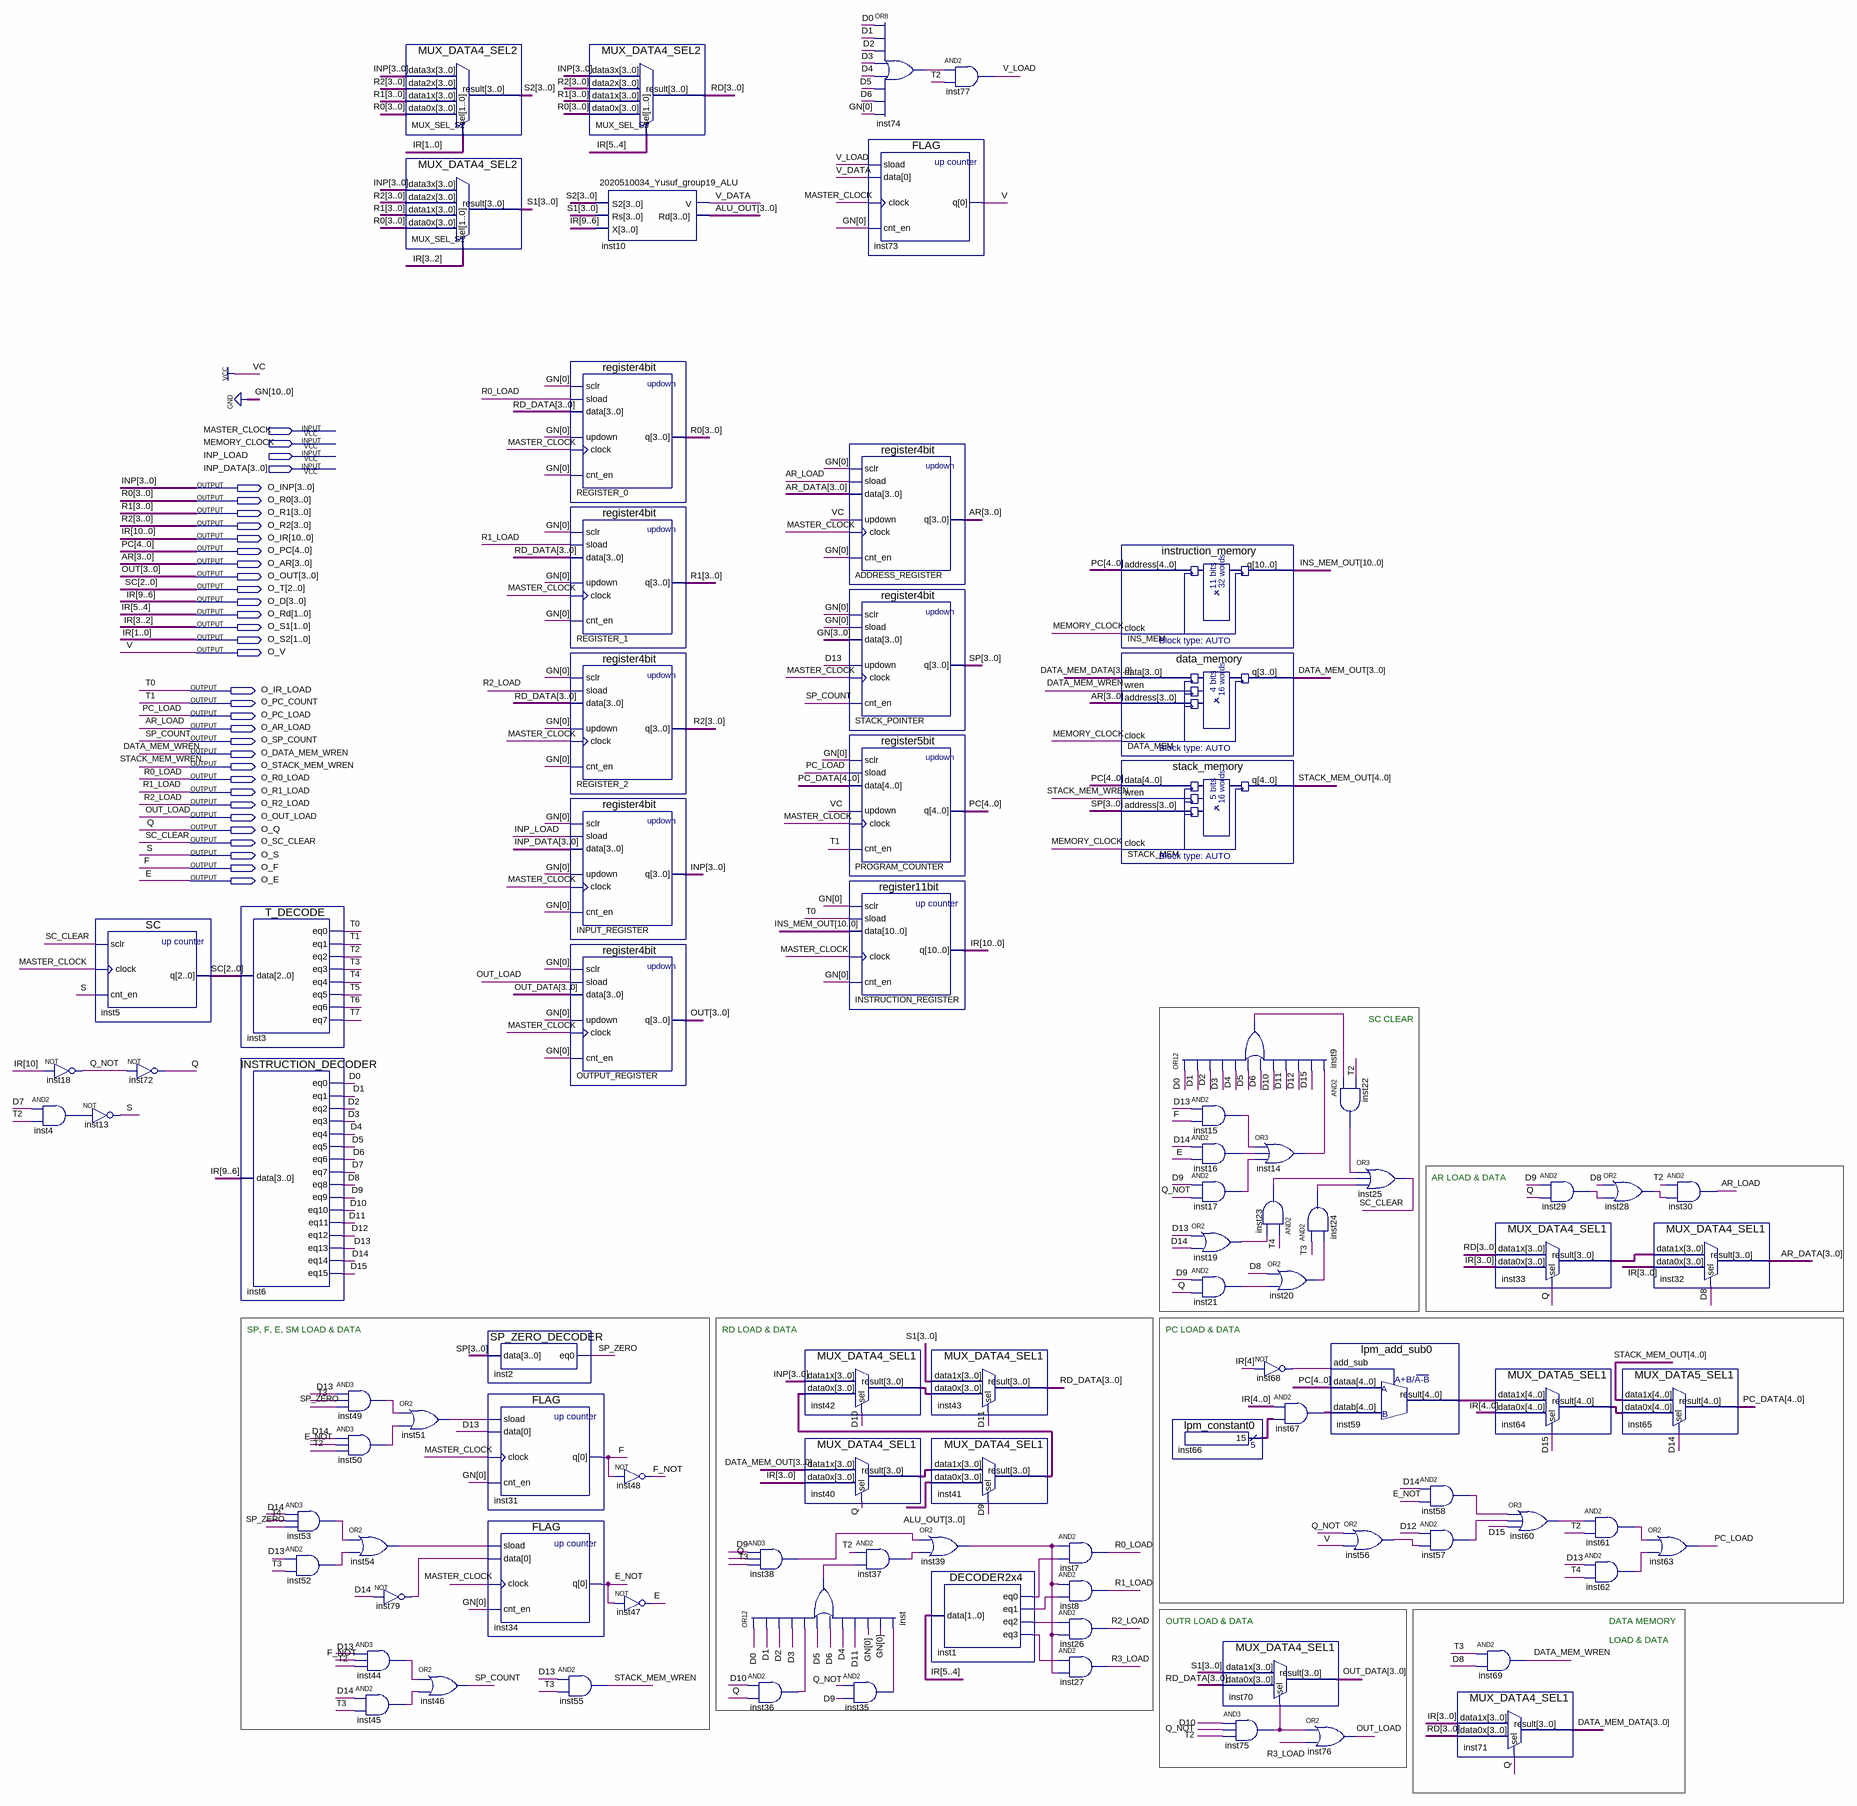
[diagram p0: schematic sheet]
// Quartus schematic 2021510008_Alperen_Aydin_Group19_Lab14_Project_DEUARC_COMBINED.bdf as structural Verilog: 92 symbols, 34 pins
module \2021510008_Alperen_Aydin_Group19_Lab14_Project_DEUARC_COMBINED  (
  input  MASTER_CLOCK,
  input  MEMORY_CLOCK,
  input  INP_LOAD,
  input  [3:0] INP_DATA,
  output [3:0] O_INP,
  output [3:0] O_R0,
  output [3:0] O_R1,
  output [3:0] O_R2,
  output [10:0] O_IR,
  output [4:0] O_PC,
  output [3:0] O_AR,
  output [3:0] O_OUT,
  output [2:0] O_T,
  output [3:0] O_D,
  output [1:0] O_Rd,
  output [1:0] O_S1,
  output [1:0] O_S2,
  output O_V,
  output O_IR_LOAD,
  output O_PC_COUNT,
  output O_PC_LOAD,
  output O_AR_LOAD,
  output O_SP_COUNT,
  output O_DATA_MEM_WREN,
  output O_STACK_MEM_WREN,
  output O_R0_LOAD,
  output O_R1_LOAD,
  output O_R2_LOAD,
  output O_OUT_LOAD,
  output O_Q,
  output O_SC_CLEAR,
  output O_S,
  output O_F,
  output O_E
);

  wire D0, D1, D2, D3, D4, D5, D6, D7, D8, D9, D10, D11, D12, D13, D14, D15, E_NOT, F_NOT, inst1_eq0,
       inst1_eq1, inst1_eq2, inst1_eq3, inst4_out, inst9_out, inst14_out, inst15_out, inst16_out, inst17_out,
       inst19_out, inst20_out, inst21_out, inst22_out, inst23_out, inst24_out, inst28_out, inst29_out,
       inst35_out, inst36_out, inst37_out, inst38_out, inst39_out, inst44_out, inst45_out, inst49_out,
       inst50_out, inst51_out, inst52_out, inst53_out, inst54_out, inst56_out, inst57_out, inst58_out,
       inst60_out, inst61_out, inst62_out, inst68_out, inst74_out, inst75_out, inst79_out, inst_out, Q_NOT,
       R3_LOAD, SP_ZERO, T2, T3, T4, T5, T6, T7, V_DATA, V_LOAD;
  wire [3:0] ALU_OUT, AR_DATA, DATA_MEM_DATA, DATA_MEM_OUT, inst33_result, inst40_result, inst41_result,
       inst42_result, OUT_DATA, RD, RD_DATA, S1, S2, SP;
  wire [4:0] inst59_result, inst64_result, inst66_result, inst67_out, PC_DATA, STACK_MEM_OUT;
  wire [10:0] INS_MEM_OUT;

  not inst18 (Q_NOT, O_IR[10]);
  and inst4 (inst4_out, D7, T2);
  SC inst5 (.sclr(O_SC_CLEAR), .clock(MASTER_CLOCK), .cnt_en(O_S), .q(O_T));
  not inst13 (O_S, inst4_out);
  not inst72 (O_Q, Q_NOT);
  T_DECODE inst3 (
    .data(O_T), .eq0(O_IR_LOAD), .eq1(O_PC_COUNT), .eq2(T2), .eq3(T3), .eq4(T4), .eq5(T5), .eq6(T6), .eq7(T7));
  INSTRUCTION_DECODER inst6 (
    .data(O_D), .eq0(D0), .eq1(D1), .eq2(D2), .eq3(D3), .eq4(D4), .eq5(D5), .eq6(D6), .eq7(D7), .eq8(D8),
    .eq9(D9), .eq10(D10), .eq11(D11), .eq12(D12), .eq13(D13), .eq14(D14), .eq15(D15));
  and inst53 (inst53_out, D14, T4, SP_ZERO);
  and inst52 (inst52_out, D13, T3);
  and inst49 (inst49_out, D13, T3, SP_ZERO);
  and inst50 (inst50_out, D14, E_NOT, T2);
  or inst54 (inst54_out, inst53_out, inst52_out);
  and inst44 (inst44_out, D13, F_NOT, T2);
  and inst45 (inst45_out, D14, T3);
  MUX_DATA4_SEL2 MUX_SEL_S2 (.data3x(O_INP), .data2x(O_R2), .data1x(O_R1), .data0x(O_R0), .sel(O_IR[1:0]), .result(S2));
  MUX_DATA4_SEL2 MUX_SEL_S1 (.data3x(O_INP), .data2x(O_R2), .data1x(O_R1), .data0x(O_R0), .sel(O_IR[3:2]), .result(S1));
  or inst51 (inst51_out, inst49_out, inst50_out);
  not inst79 (inst79_out, D14);
  or inst46 (O_SP_COUNT, inst44_out, inst45_out);
  SP_ZERO_DECODER inst2 (.data(SP), .eq0(SP_ZERO));
  FLAG inst31 (.sload(inst51_out), .data(D13), .clock(MASTER_CLOCK), .cnt_en(1'b0), .q(O_F));
  FLAG inst34 (.sload(inst54_out), .data(inst79_out), .clock(MASTER_CLOCK), .cnt_en(1'b0), .q(E_NOT));
  register4bit REGISTER_0 (
    .sclr(1'b0), .sload(O_R0_LOAD), .data(RD_DATA), .updown(1'b0), .clock(MASTER_CLOCK), .cnt_en(1'b0),
    .q(O_R0));
  register4bit REGISTER_1 (
    .sclr(1'b0), .sload(O_R1_LOAD), .data(RD_DATA), .updown(1'b0), .clock(MASTER_CLOCK), .cnt_en(1'b0),
    .q(O_R1));
  register4bit REGISTER_2 (
    .sclr(1'b0), .sload(O_R2_LOAD), .data(RD_DATA), .updown(1'b0), .clock(MASTER_CLOCK), .cnt_en(1'b0),
    .q(O_R2));
  register4bit INPUT_REGISTER (
    .sclr(1'b0), .sload(INP_LOAD), .data(INP_DATA), .updown(1'b0), .clock(MASTER_CLOCK), .cnt_en(1'b0),
    .q(O_INP));
  register4bit OUTPUT_REGISTER (
    .sclr(1'b0), .sload(O_OUT_LOAD), .data(OUT_DATA), .updown(1'b0), .clock(MASTER_CLOCK), .cnt_en(1'b0),
    .q(O_OUT));
  and inst55 (O_STACK_MEM_WREN, D13, T3);
  MUX_DATA4_SEL2 MUX_SEL_S3 (.data3x(O_INP), .data2x(O_R2), .data1x(O_R1), .data0x(O_R0), .sel(O_IR[5:4]), .result(RD));
  \2020510034_Yusuf_group19_ALU  inst10 (.S2(S2), .Rs(S1), .X(O_D), .V(V_DATA), .Rd(ALU_OUT));
  not inst48 (F_NOT, O_F);
  not inst47 (O_E, E_NOT);
  and inst38 (inst38_out, D9, O_Q, T3);
  or inst (inst_out, D0, D1, D2, D3, inst36_out, D5, D6, D4, D11, 1'b0, 1'b0, inst35_out);
  and inst36 (inst36_out, D10, O_Q);
  MUX_DATA4_SEL1 inst42 (.data1x(O_INP), .data0x(inst41_result), .sel(D10), .result(inst42_result));
  MUX_DATA4_SEL1 inst40 (.data1x(DATA_MEM_OUT), .data0x(O_IR[3:0]), .sel(O_Q), .result(inst40_result));
  or inst74 (inst74_out, D0, D1, D2, D3, D4, D5, D6, 1'b0);
  FLAG inst73 (.sload(V_LOAD), .data(V_DATA), .clock(MASTER_CLOCK), .cnt_en(1'b0), .q(O_V));
  register4bit ADDRESS_REGISTER (
    .sclr(1'b0), .sload(O_AR_LOAD), .data(AR_DATA), .updown(1'b1), .clock(MASTER_CLOCK), .cnt_en(1'b0),
    .q(O_AR));
  register4bit STACK_POINTER (
    .sclr(1'b0), .sload(1'b0), .data(4'b0000), .updown(D13), .clock(MASTER_CLOCK), .cnt_en(O_SP_COUNT), .q(SP));
  register5bit PROGRAM_COUNTER (
    .sclr(1'b0), .sload(O_PC_LOAD), .data(PC_DATA), .updown(1'b1), .clock(MASTER_CLOCK), .cnt_en(O_PC_COUNT),
    .q(O_PC));
  register11bit INSTRUCTION_REGISTER (
    .sclr(1'b0), .sload(O_IR_LOAD), .data(INS_MEM_OUT), .clock(MASTER_CLOCK), .cnt_en(1'b0),
    .q({O_IR[10], O_D, O_IR[5:0]}));
  and inst37 (inst37_out, T2, inst_out);
  and inst35 (inst35_out, Q_NOT, D9);
  or inst39 (inst39_out, inst38_out, inst37_out);
  and inst77 (V_LOAD, inst74_out, T2);
  MUX_DATA4_SEL1 inst43 (.data1x(S1), .data0x(inst42_result), .sel(D11), .result(RD_DATA));
  MUX_DATA4_SEL1 inst41 (.data1x(inst40_result), .data0x(ALU_OUT), .sel(D9), .result(inst41_result));
  DECODER2x4 inst1 (.data(O_IR[5:4]), .eq0(inst1_eq0), .eq1(inst1_eq1), .eq2(inst1_eq2), .eq3(inst1_eq3));
  and inst7 (O_R0_LOAD, inst39_out, inst1_eq0);
  and inst8 (O_R1_LOAD, inst39_out, inst1_eq1);
  and inst26 (O_R2_LOAD, inst1_eq2, inst39_out);
  and inst27 (R3_LOAD, inst1_eq3, inst39_out);
  instruction_memory INS_MEM (.address(O_PC), .clock(MEMORY_CLOCK), .q(INS_MEM_OUT));
  data_memory DATA_MEM (
    .data(DATA_MEM_DATA), .wren(O_DATA_MEM_WREN), .address(O_AR), .clock(MEMORY_CLOCK), .q(DATA_MEM_OUT));
  stack_memory STACK_MEM (.data(O_PC), .wren(O_STACK_MEM_WREN), .address(SP), .clock(MEMORY_CLOCK), .q(STACK_MEM_OUT));
  or inst9 (inst9_out, D0, D1, D2, D3, D4, D5, D6, D10, D11, D12, D15, inst14_out);
  lpm_constant0 inst66 (.result(inst66_result));
  and inst15 (inst15_out, D13, O_F);
  and inst16 (inst16_out, D14, O_E);
  and inst17 (inst17_out, D9, Q_NOT);
  or inst19 (inst19_out, D13, D14);
  and inst21 (inst21_out, D9, O_Q);
  MUX_DATA4_SEL1 inst70 (.data1x(S1), .data0x(RD_DATA), .sel(inst75_out), .result(OUT_DATA));
  and inst75 (inst75_out, D10, Q_NOT, T2);
  or inst14 (inst14_out, inst15_out, inst16_out, inst17_out);
  and inst23 (inst23_out, T4, inst19_out);
  or inst20 (inst20_out, D8, inst21_out);
  not inst68 (inst68_out, O_IR[4]);
  assign inst67_out = O_IR[4:0] & inst66_result;  // AND2 inst67, 5 bits wide
  and inst22 (inst22_out, inst9_out, T2);
  and inst24 (inst24_out, T3, inst20_out);
  lpm_add_sub0 inst59 (.add_sub(inst68_out), .dataa(O_PC), .datab(inst67_out), .result(inst59_result));
  or inst76 (O_OUT_LOAD, inst75_out, R3_LOAD);
  or inst25 (O_SC_CLEAR, inst22_out, inst23_out, inst24_out);
  or inst56 (inst56_out, Q_NOT, O_V);
  and inst58 (inst58_out, D14, E_NOT);
  and inst57 (inst57_out, D12, inst56_out);
  and inst69 (O_DATA_MEM_WREN, T3, D8);
  MUX_DATA4_SEL1 inst71 (.data1x(O_IR[3:0]), .data0x(RD), .sel(O_Q), .result(DATA_MEM_DATA));
  MUX_DATA4_SEL1 inst33 (.data1x(RD), .data0x(O_IR[3:0]), .sel(O_Q), .result(inst33_result));
  MUX_DATA5_SEL1 inst64 (.data1x(inst59_result), .data0x(O_IR[4:0]), .sel(D15), .result(inst64_result));
  or inst60 (inst60_out, inst58_out, inst57_out, D15);
  and inst29 (inst29_out, D9, O_Q);
  and inst61 (inst61_out, inst60_out, T2);
  and inst62 (inst62_out, D13, T4);
  or inst28 (inst28_out, D8, inst29_out);
  MUX_DATA5_SEL1 inst65 (.data1x(STACK_MEM_OUT), .data0x(inst64_result), .sel(D14), .result(PC_DATA));
  and inst30 (O_AR_LOAD, T2, inst28_out);
  MUX_DATA4_SEL1 inst32 (.data1x(inst33_result), .data0x(O_IR[3:0]), .sel(D8), .result(AR_DATA));
  or inst63 (O_PC_LOAD, inst61_out, inst62_out);

  assign O_IR[9:6] = O_D;
  assign O_Rd = O_IR[5:4];
  assign O_S1 = O_IR[3:2];
  assign O_S2 = O_IR[1:0];

  // Other names for the same wires on the sheet: AR[3:0] = O_AR; AR_LOAD = O_AR_LOAD; DATA_MEM_WREN = O_DATA_MEM_WREN;
  //   E = O_E; F = O_F; INP[3:0] = O_INP; IR[10:0] = {O_IR[10], O_D, O_IR[5:0]}; OUT[3:0] = O_OUT;
  //   OUT_LOAD = O_OUT_LOAD; PC[4:0] = O_PC; PC_LOAD = O_PC_LOAD; Q = O_Q; R0[3:0] = O_R0; R0_LOAD = O_R0_LOAD;
  //   R1[3:0] = O_R1; R1_LOAD = O_R1_LOAD; R2[3:0] = O_R2; R2_LOAD = O_R2_LOAD; S = O_S; SC[2:0] = O_T;
  //   SC_CLEAR = O_SC_CLEAR; SP_COUNT = O_SP_COUNT; STACK_MEM_WREN = O_STACK_MEM_WREN; T0 = O_IR_LOAD;
  //   T1 = O_PC_COUNT; V = O_V

  // Notes on the sheet:
  //   SC CLEAR
  //   AR LOAD & DATA
  //   SP, F, E, SM LOAD & DATA
  //   RD LOAD & DATA
  //   PC LOAD & DATA
  //   OUTR LOAD & DATA
  //   DATA MEMORY
  //   LOAD & DATA
endmodule
